# Altium schematic sheet PLC in.SchDoc: Enclosure PLC inputs
size A4; Author: Felipe Besser P.; CompanyName: Observatorio Las Campanas; DrawnBy: Felipe Besser P.; DocumentNumber: 2; Revision: 1; SheetNumber: 3; SheetTotal: 3
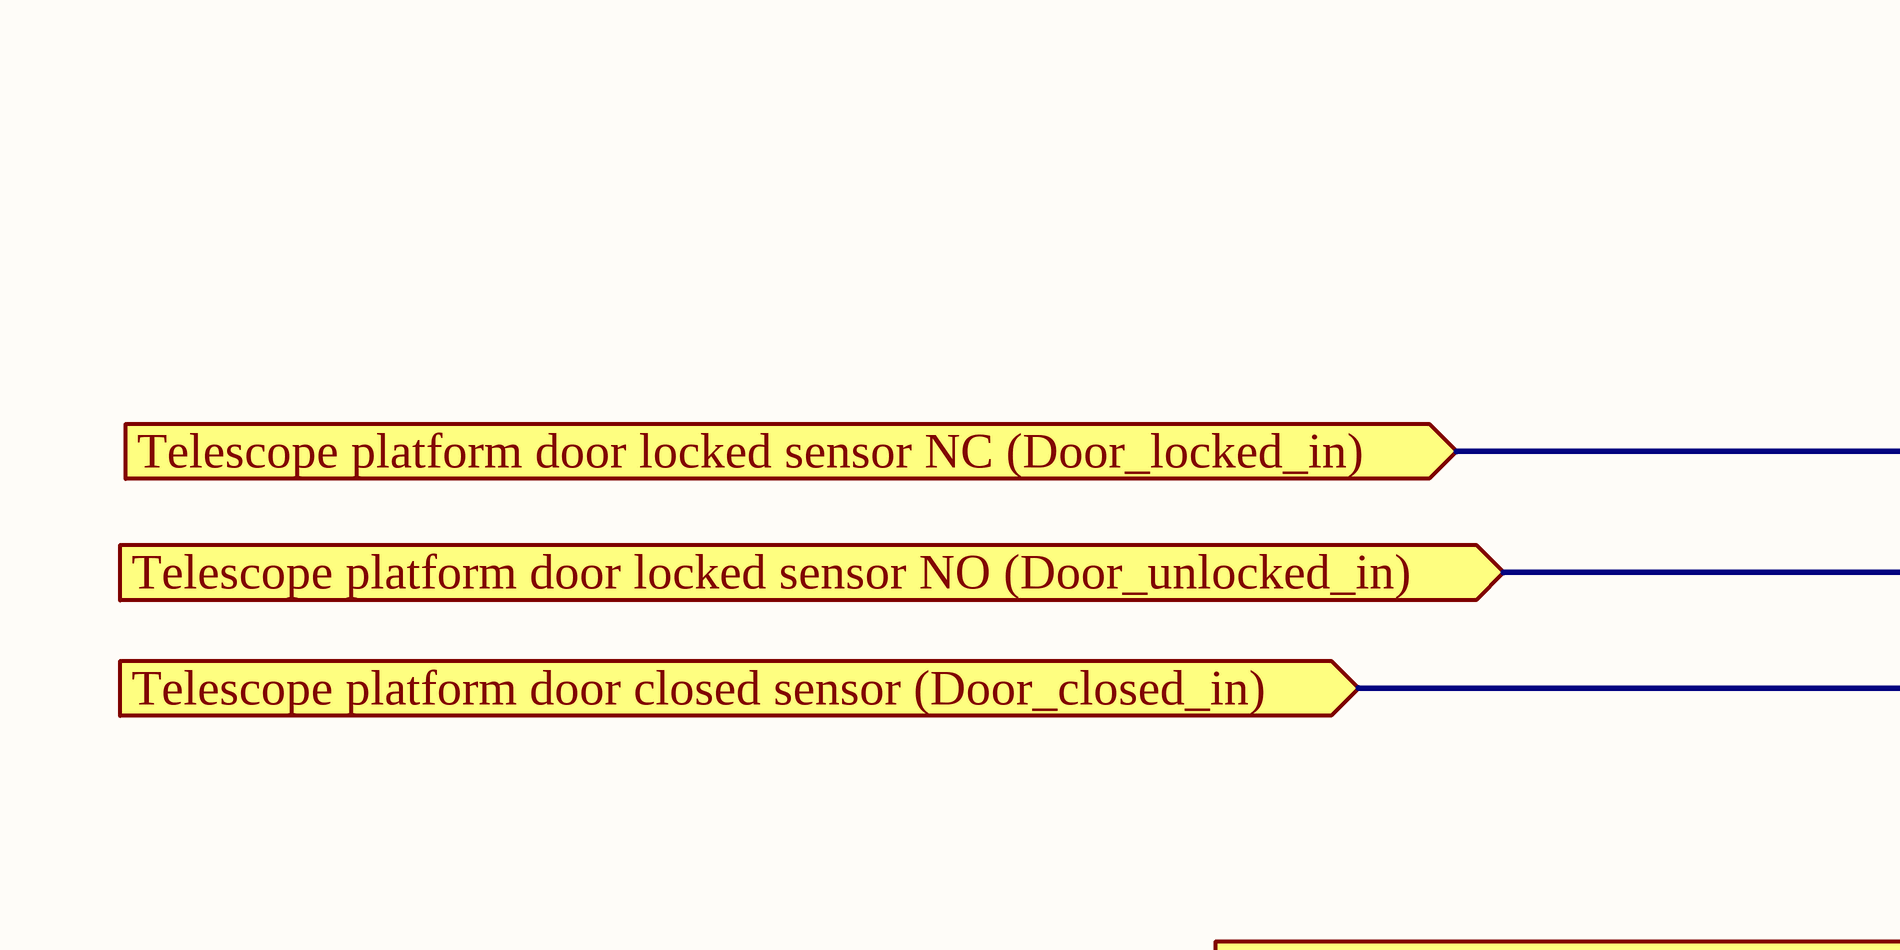
[diagram p0: PLC in.SchDoc, centre column 3 of 4]
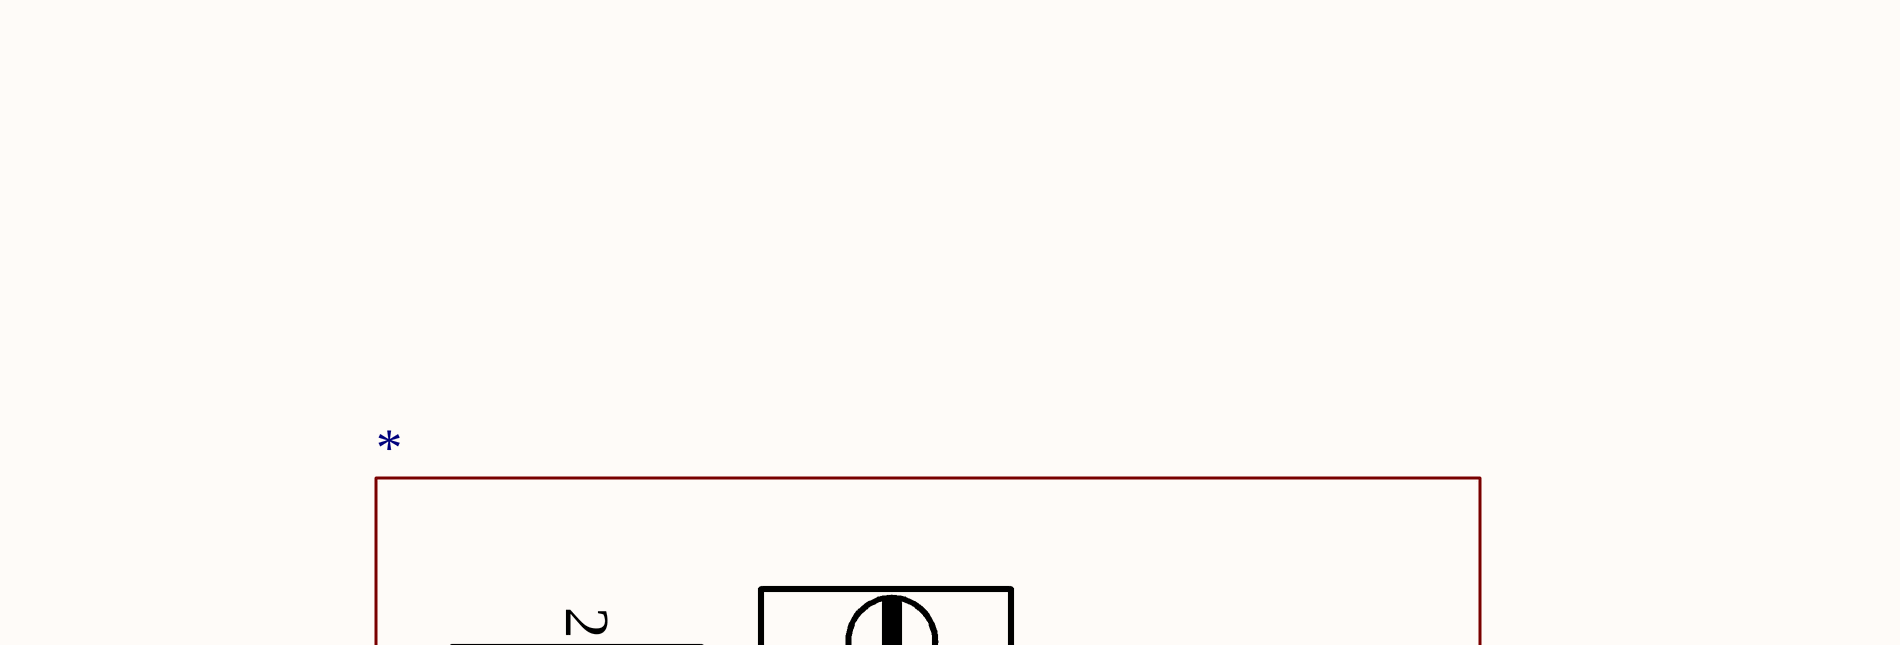
[diagram p1: PLC in.SchDoc, centre column 4 of 4]
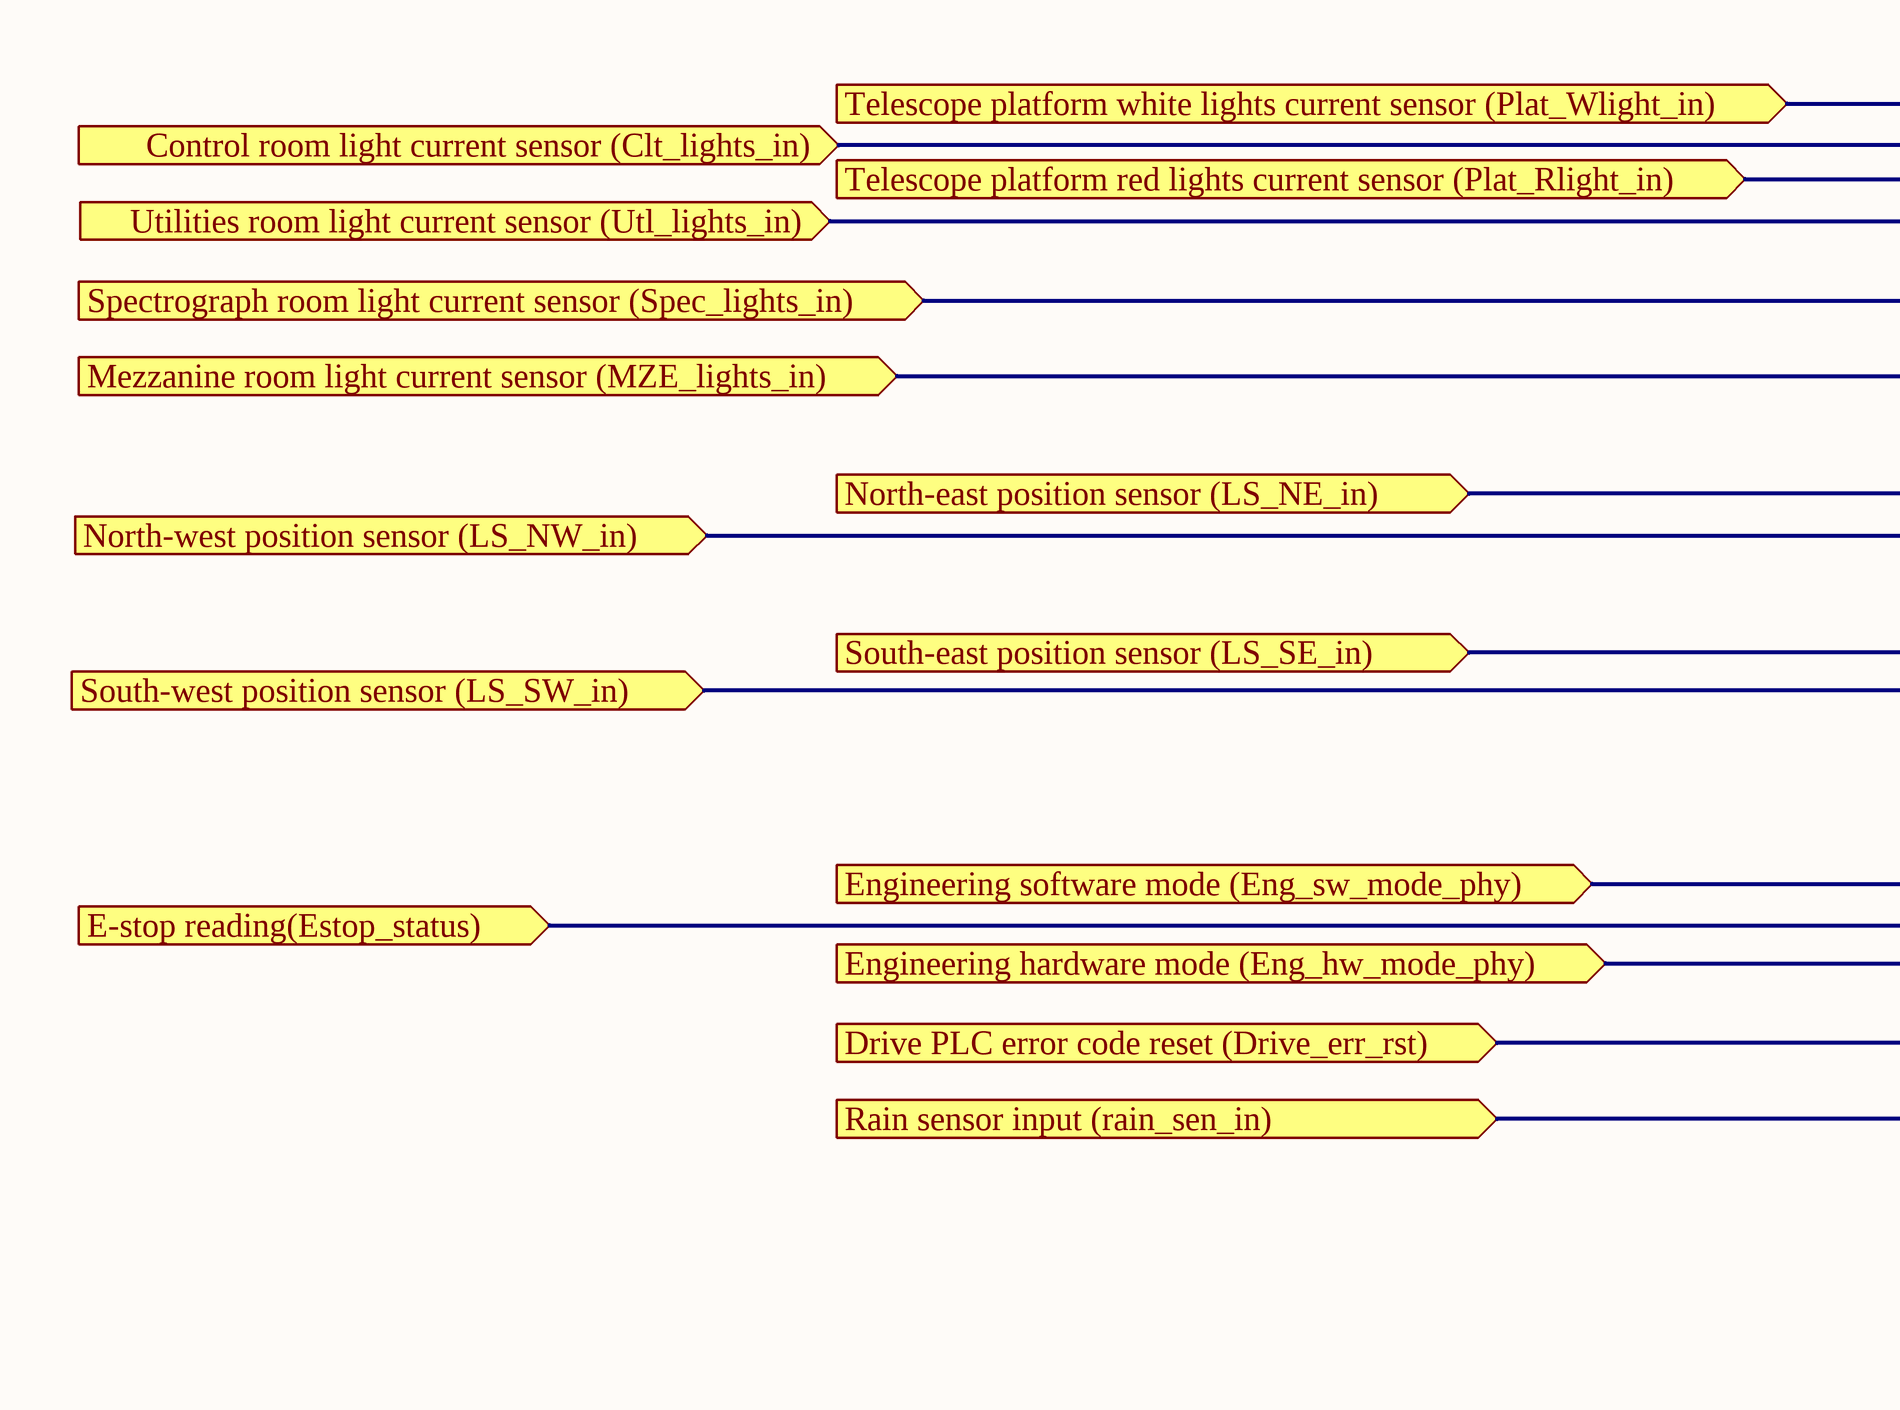
[diagram p2: PLC in.SchDoc, bottom column 3 of 4]
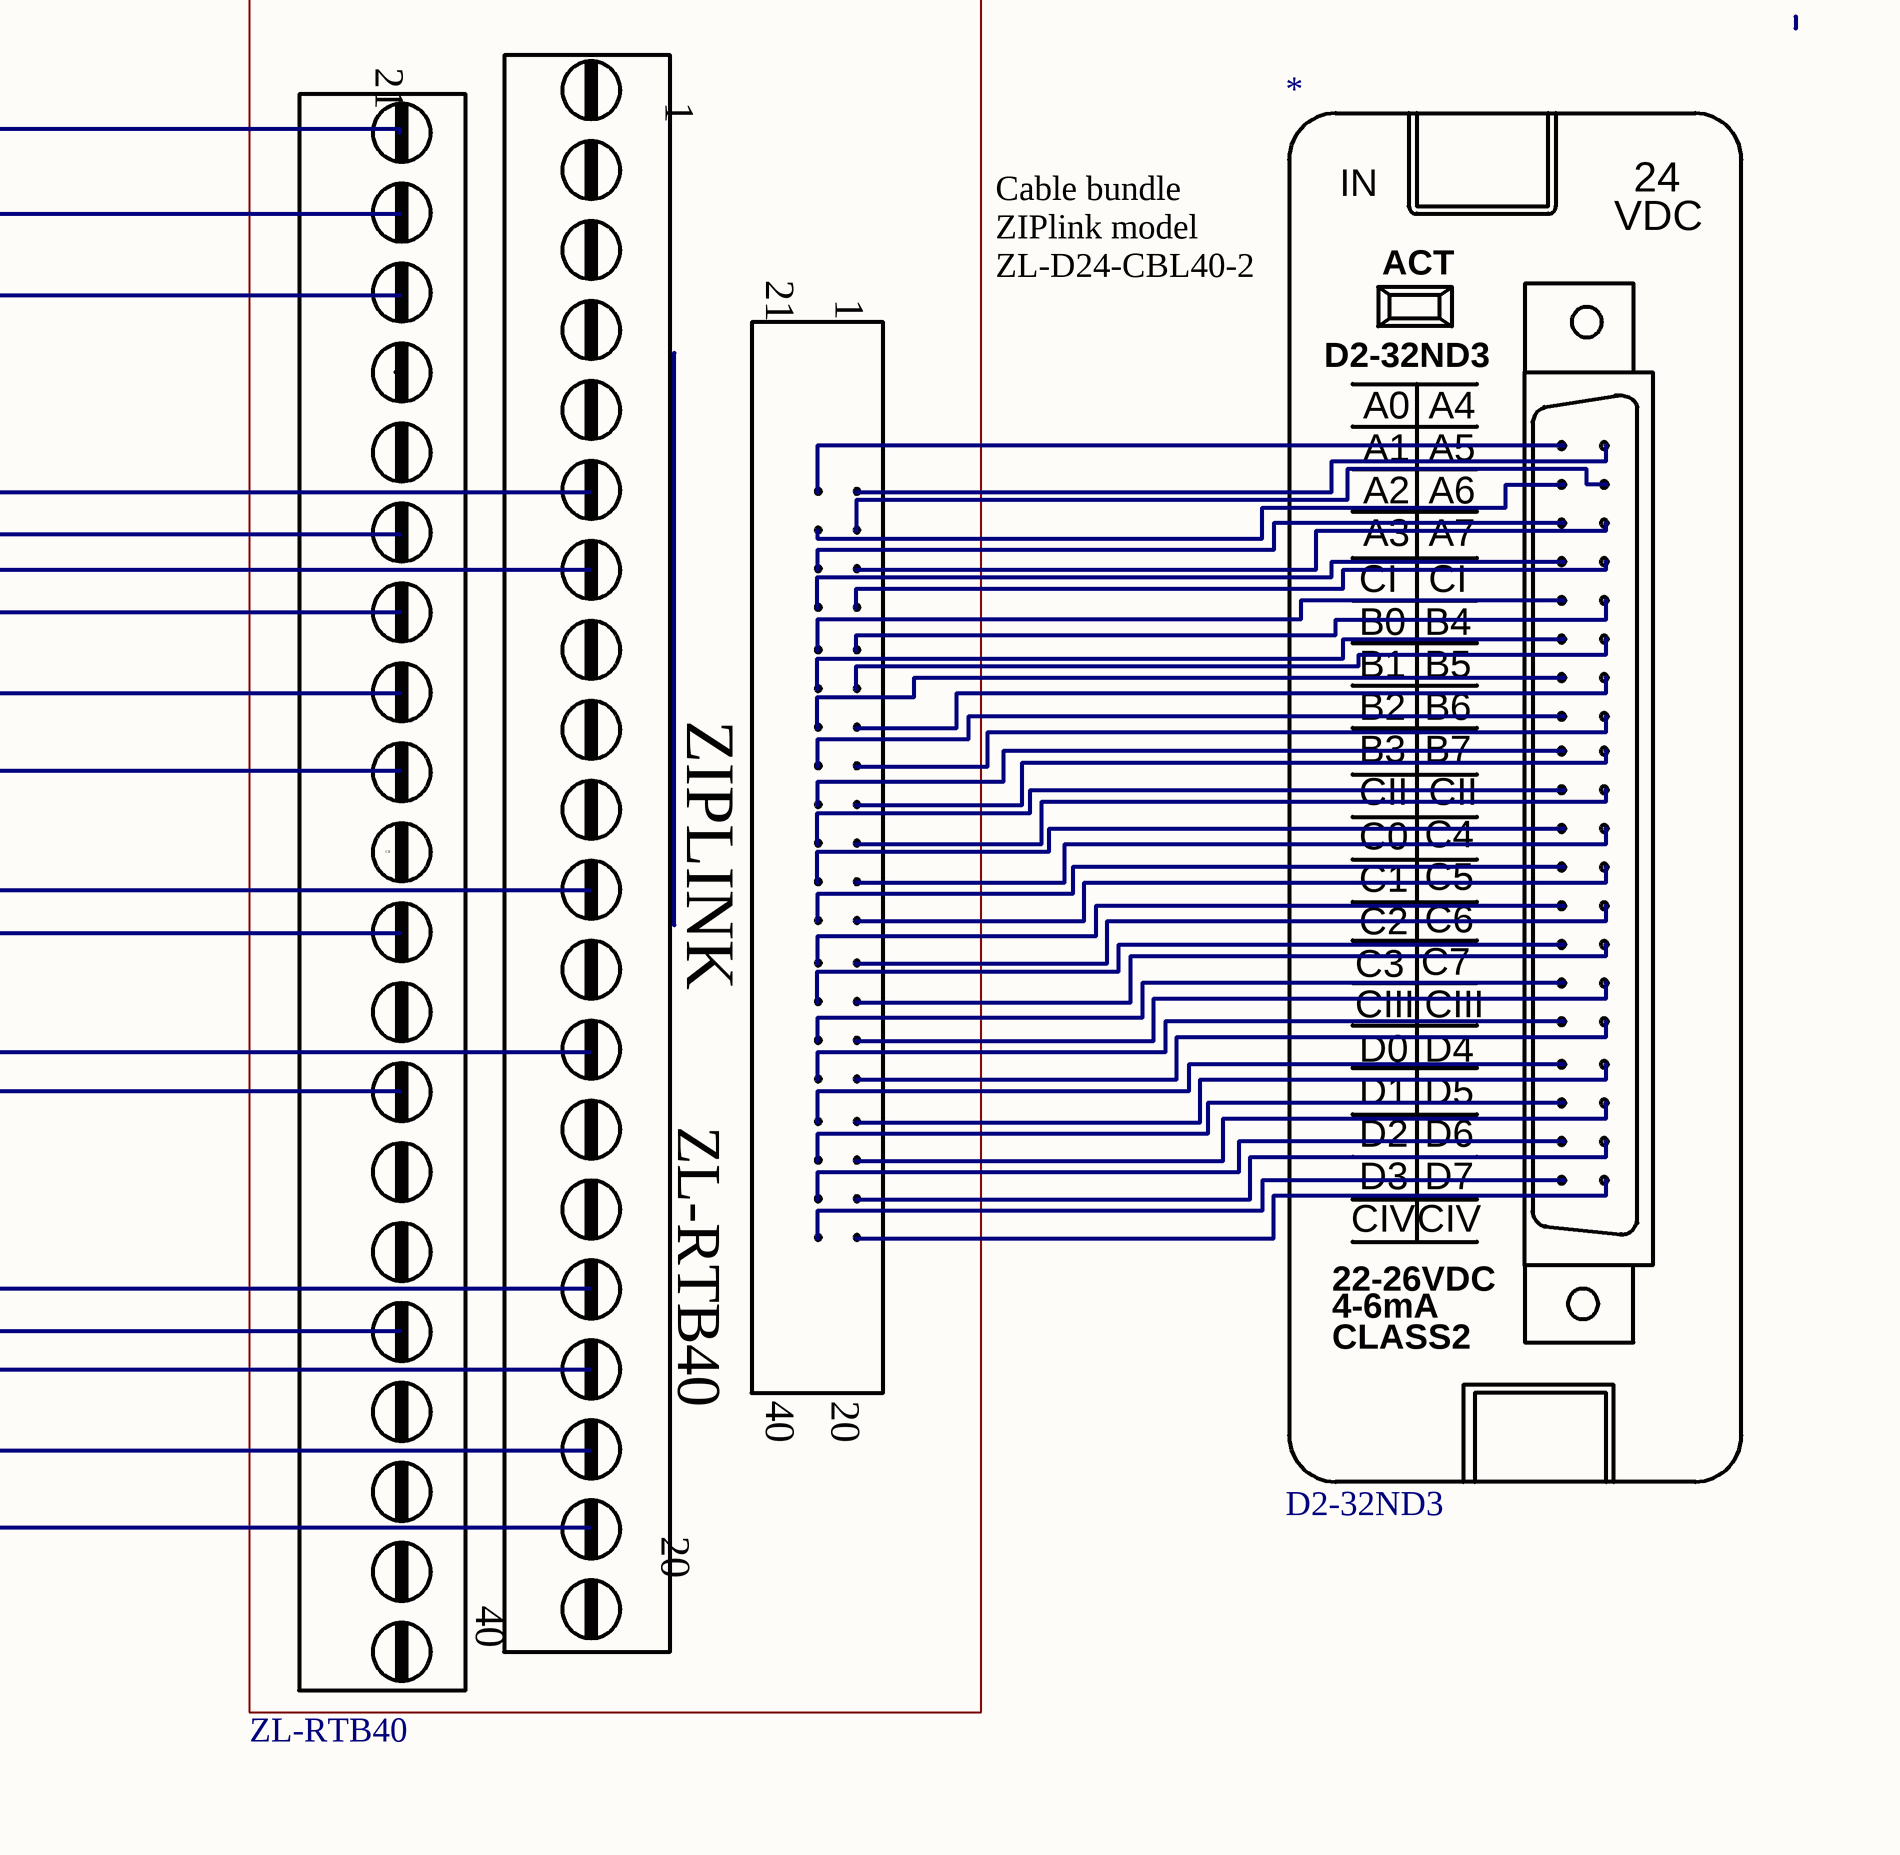
[diagram p3: PLC in.SchDoc, bottom column 4 of 4]

## Parts
(Parts that share a designator on the sheet are numbered #1, #2 ... from top to bottom, then left to right.)
*#1  ZL-RTB40
*#2  D2-32ND3

## Ports
Control room light current sensor (Clt_lights_in) (in), Drive PLC error code reset (Drive_err_rst) (in), E-stop reading(Estop_status) (in), Engineering hardware mode (Eng_hw_mode_phy) (in), Engineering software mode (Eng_sw_mode_phy) (in), Mezzanine room light current sensor (MZE_lights_in) (in), North-east position sensor (LS_NE_in) (in), North-west position sensor (LS_NW_in) (in), Rain sensor input (rain_sen_in) (in), South-east position sensor (LS_SE_in) (in), South-west position sensor (LS_SW_in) (in), Spectrograph room light current sensor (Spec_lights_in) (in), Telescope platform door closed sensor (Door_closed_in) (in), Telescope platform door locked sensor NC (Door_locked_in) (in), Telescope platform door locked sensor NO (Door_unlocked_in)  (in), Telescope platform red lights current sensor (Plat_Rlight_in) (in), Telescope platform white lights current sensor (Plat_Wlight_in) (in), Utilities room light current sensor (Utl_lights_in) (in)

## Nets
Control room light current sensor (Clt_lights_in): *#1.?46(B0) ; port Control room light current sensor (Clt_lights_in)
Drive PLC error code reset (Drive_err_rst): *#1.?63(D6) ; port Drive PLC error code reset (Drive_err_rst)
E-stop reading(Estop_status): *#1.?56(D0) ; port E-stop reading(Estop_status)
Engineering hardware mode (Eng_hw_mode_phy): *#1.?64(D5) ; port Engineering hardware mode (Eng_hw_mode_phy)
Engineering software mode (Eng_sw_mode_phy): *#1.?65(D4) ; port Engineering software mode (Eng_sw_mode_phy)
Mezzanine room light current sensor (MZE_lights_in): *#1.?49(B3) ; port Mezzanine room light current sensor (MZE_lights_in)
North-east position sensor (LS_NE_in): *#1.?70(C4) ; port North-east position sensor (LS_NE_in)
North-west position sensor (LS_NW_in): *#1.?51(C0) ; port North-west position sensor (LS_NW_in)
Rain sensor input (rain_sen_in): *#1.?62(D7) ; port Rain sensor input (rain_sen_in)
South-east position sensor (LS_SE_in): *#1.?68(C6) ; port South-east position sensor (LS_SE_in)
South-west position sensor (LS_SW_in): *#1.?53(C2) ; port South-west position sensor (LS_SW_in)
Spectrograph room light current sensor (Spec_lights_in): *#1.?48(B2) ; port Spectrograph room light current sensor (Spec_lights_in)
Telescope platform door closed sensor (Door_closed_in): *#1.?43(A2) ; port Telescope platform door closed sensor (Door_closed_in)
Telescope platform door locked sensor NC (Door_locked_in): *#1.?41(A0) ; port Telescope platform door locked sensor NC (Door_locked_in)
Telescope platform door locked sensor NO (Door_unlocked_in) : *#1.?42(A1) ; port Telescope platform door locked sensor NO (Door_unlocked_in) 
Telescope platform red lights current sensor (Plat_Rlight_in): *#1.?74(B5) ; port Telescope platform red lights current sensor (Plat_Rlight_in)
Telescope platform white lights current sensor (Plat_Wlight_in): *#1.?75(B4) ; port Telescope platform white lights current sensor (Plat_Wlight_in)
Utilities room light current sensor (Utl_lights_in): *#1.?47(B1) ; port Utilities room light current sensor (Utl_lights_in)
Net*#1_?1: *#1.?1 *#2.?1(A0)
Net*#1_?2: *#1.?2 *#2.?2(A1)
Net*#1_?3: *#1.?3 *#2.?3(A2)
Net*#1_?4: *#1.?4 *#2.?4(A3)
Net*#1_?5: *#1.?5 *#2.?5(CI)
Net*#1_?6: *#1.?6 *#2.?6(B0)
Net*#1_?7: *#1.?7 *#2.?7(B1)
Net*#1_?8: *#1.?8 *#2.?8(B2)
Net*#1_?9: *#1.?9 *#2.?9(B3)
Net*#1_?10: *#1.?10 *#2.?10(CII)
Net*#1_?11: *#1.?11 *#2.?11(C0)
Net*#1_?12: *#1.?12 *#2.?12(C1)
Net*#1_?13: *#1.?13 *#2.?13(C2)
Net*#1_?14: *#1.?14 *#2.?14(C3)
Net*#1_?15: *#1.?15 *#2.?15(CIII)
Net*#1_?16: *#1.?16 *#2.?16(D0)
Net*#1_?17: *#1.?17 *#2.?17(D1)
Net*#1_?18: *#1.?18 *#2.?18(D2)
Net*#1_?19: *#1.?19 *#2.?19(D3)
Net*#1_?20: *#1.?20 *#2.?20(CIV)
Net*#1_?21: *#1.?21 *#2.?21(CIV)
Net*#1_?22: *#1.?22 *#2.?22(D7)
Net*#1_?23: *#1.?23 *#2.?23(D6)
Net*#1_?24: *#1.?24 *#2.?24(D5)
Net*#1_?25: *#1.?25 *#2.?25(D4)
Net*#1_?26: *#1.?26 *#2.?26(CIII)
Net*#1_?27: *#1.?27 *#2.?27(C7)
Net*#1_?28: *#1.?28 *#2.?28(C6)
Net*#1_?29: *#1.?29 *#2.?29(C5)
Net*#1_?30: *#1.?30 *#2.?30(C4)
Net*#1_?31: *#1.?31 *#2.?31(CII)
Net*#1_?32: *#1.?32 *#2.?32(B7)
Net*#1_?33: *#1.?33 *#2.?33(B6)
Net*#1_?34: *#1.?34 *#2.?34(B5)
Net*#1_?35: *#1.?35 *#2.?35(B4)
Net*#1_?36: *#1.?36 *#2.?36(CI)
Net*#1_?37: *#1.?37 *#2.?37(A7)
Net*#1_?38: *#1.?38 *#2.?38(A6)
Net*#1_?39: *#1.?39 *#2.?39(A5)
Net*#1_?40: *#1.?40 *#2.?40(A4)

Not connected (* = marked no-connect by the designer): *#1 ?44(A3) ?45(CI) ?50(CII) ?52(C1) ?54(C3) ?55(CIII) ?57(D1) ?58(D2) ?59(D3) ?60(CIV) ?61(CIV) ?66(CIII) ?67(C7) ?69(C5) ?71(CII) ?72(B7) ?73(B6) ?76(CI) ?77(A7) ?78(A6) ?79(A5) ?80(A4)

## Notes on the sheet
- (near *#1) Cable bundle ZIPlink model ZL-D24-CBL40-2
- (in symbol D2-32ND3) IN; 24; VDC; ACT; 22-26VDC; 4-6mA; CLASS2
- (in symbol ZL-RTB40) ZIPLINK